# Altium schematic sheet Sheet1.SchDoc
size A4; SheetNumber: 1; SheetTotal: 2
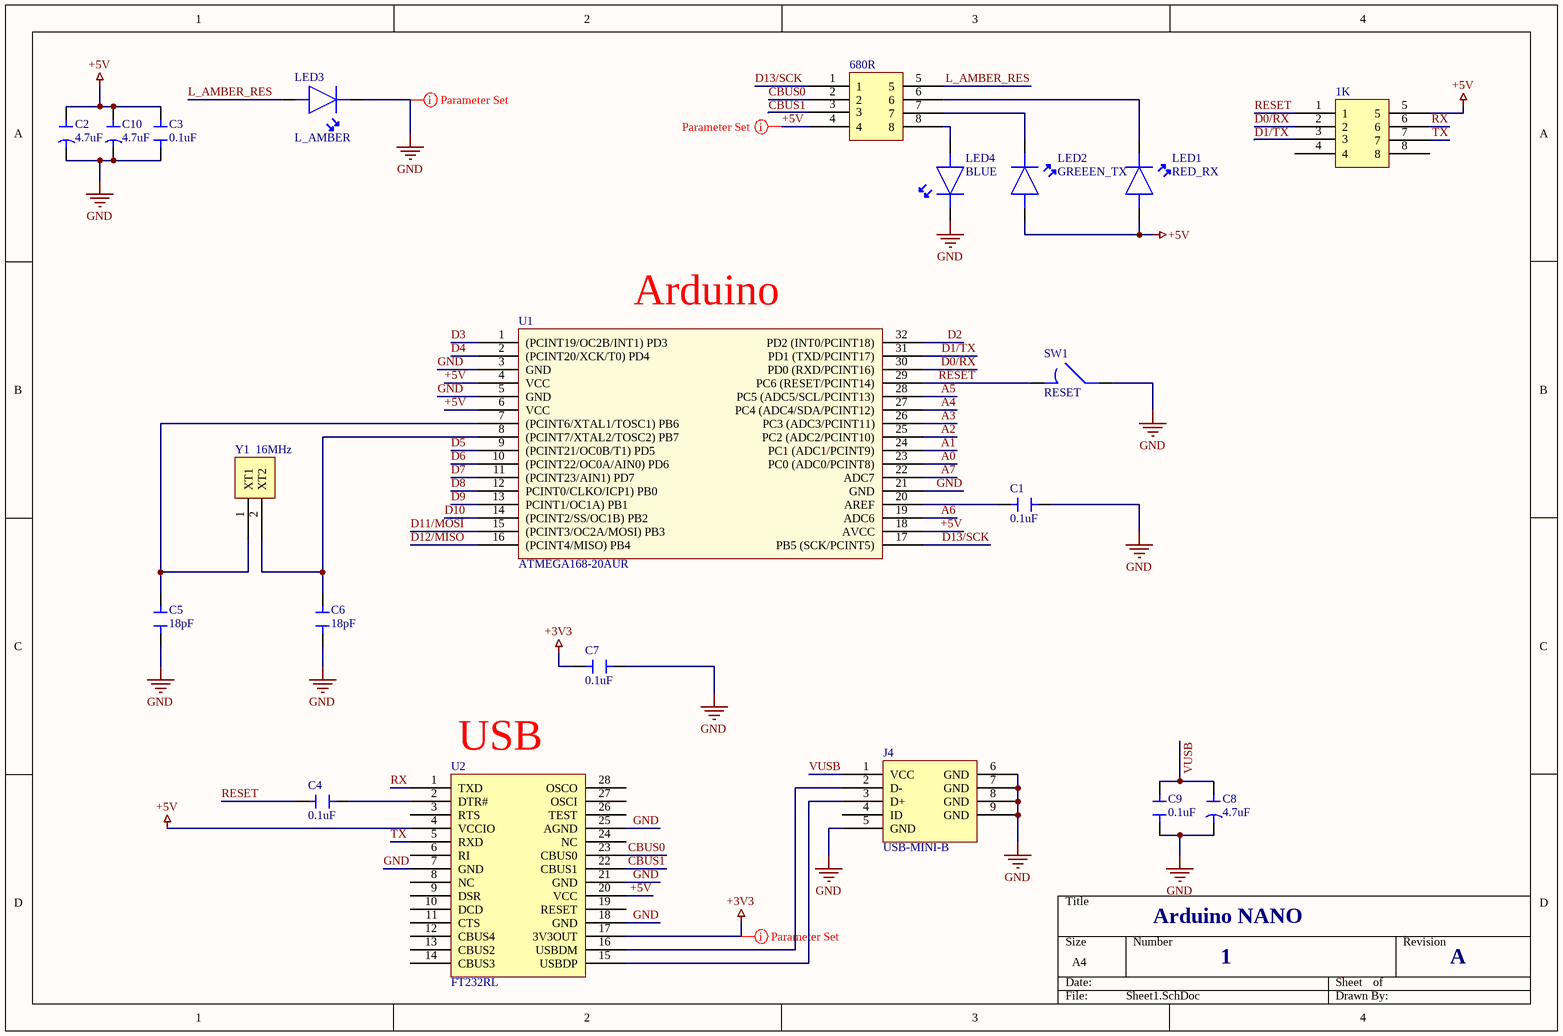
[diagram p0: Sheet1.SchDoc]

## Parts
1K  YC164-JR-071KL  [Quad8 RES ARRAY]  (value not drawn)
680R  YC164-JR-07680RL  [Quad8 RES ARRAY]  (value not drawn)
C1  0.1uF  [Capacitor 0805]
C2  4.7uF  [Tant 7343-43]
C3  0.1uF  [Capacitor 0805]
C4  0.1uF  [Capacitor 0805]
C5  18pF  [Capacitor 0805]
C6  18pF  [Capacitor 0805]
C7  0.1uF  [Capacitor 0805]
C8  4.7uF  [Tant 7343-43]
C9  0.1uF  [Capacitor 0805]
C10  4.7uF  [Tant 7343-43]
J4  USB-MINI-B  [Mini B]
LED1  RED_RX  [LED 0805]
LED2  GREEEN_TX  [LED 0805]
LED3  L_AMBER  [LED 0805]
LED4  BLUE  [LED 0805]
SW1  RESET  [PUSH BUTTON]
U1  ATMEGA168-20AUR  [TQFP]
U2  FT232RL  [Quad28 FTDI]
Y1  16MHz  [TH XT]

## Nets
+3V3: C7.2 U2.17(3V3OUT)
+5V: 1K.5 680R.4 C2.1 C3.1 C10.1 LED1.8 LED2.8 U1.4(VCC) U1.6(VCC) U1.18(AVCC) U2.4(VCCIO) U2.20(VCC)
GND: C1.2 C2.2 C3.2 C5.1 C6.1 C7.1 C8.2 C9.2 C10.2 J4.5(GND) J4.6(GND) J4.7(GND) J4.8(GND) J4.9(GND) LED3.7 LED4.7 SW1.10 U1.3(GND) U1.5(GND) U1.21(GND) U2.7(GND) U2.18(GND) U2.21(GND) U2.25(AGND)
A0: U1.23(PC0_(ADC0/PCINT8))
A1: U1.24(PC1_(ADC1/PCINT9))
A2: U1.25(PC2_(ADC2/PCINT10))
A3: U1.26(PC3_(ADC3/PCINT11))
A4: U1.27(PC4_(ADC4/SDA/PCINT12))
A5: U1.28(PC5_(ADC5/SCL/PCINT13))
A6: U1.19(ADC6)
A7: U1.22(ADC7)
CBUS0: 680R.2 U2.23(CBUS0)
CBUS1: 680R.3 U2.22(CBUS1)
D0/RX: 1K.2 U1.30(PD0_(RXD/PCINT16))
D1/TX: 1K.3 U1.31(PD1_(TXD/PCINT17))
D2: U1.32(PD2_(INT0/PCINT18))
D3: U1.1((PCINT19/OC2B/INT1)_PD3)
D4: U1.2((PCINT20/XCK/T0)_PD4)
D5: U1.9((PCINT21/OC0B/T1)_PD5)
D6: U1.10((PCINT22/OC0A/AIN0)_PD6)
D7: U1.11((PCINT23/AIN1)_PD7)
D8: U1.12(PCINT0/CLKO/ICP1)_PB0)
D9: U1.13(PCINT1/OC1A)_PB1)
D10: U1.14((PCINT2/SS/OC1B)_PB2)
D11/MOSI: U1.15((PCINT3/OC2A/MOSI)_PB3)
D12/MISO: U1.16((PCINT4/MISO)_PB4)
D13/SCK: 680R.1 U1.17(PB5_(SCK/PCINT5))
L_AMBER_RES: 680R.5 LED3.8
RESET: 1K.1 C4.2 SW1.9 U1.29(PC6_(RESET/PCINT14))
RX: 1K.6 U2.1(TXD)
TX: 1K.7 U2.5(RXD)
VUSB: C8.1 C9.1 J4.1(VCC)
Net680R_6: 680R.6 LED1.7
Net680R_7: 680R.7 LED2.7
Net680R_8: 680R.8 LED4.8
NetC1_1: C1.1 U1.20(AREF)
NetC4_1: C4.1 U2.2(DTR#)
NetC5_2: C5.2 U1.7((PCINT6/XTAL1/TOSC1)_PB6) Y1.1(XT1)
NetC6_2: C6.2 U1.8((PCINT7/XTAL2/TOSC2)_PB7) Y1.2(XT2)
NetJ4_2: J4.2(D-) U2.16(USBDM)
NetJ4_3: J4.3(D+) U2.15(USBDP)

Not connected (* = marked no-connect by the designer): 1K 4 8; J4 4(ID); U2 3(RTS) 6(RI) 8(NC) 9(DSR) 10(DCD) 11(CTS) 12(CBUS4) 13(CBUS2) 14(CBUS3) 19(RESET) 24(NC) 26(TEST) 27(OSCI) 28(OSCO)

## Layout directives
rule Width Constraint [Pref Width = 0.3mm    Min Width = 0.3mm    Max Width = 0.3mm]: +3V3, +5V, GND

## Notes on the sheet
- (near U1) Arduino
- (near U2) USB
- Arduino NANO
- 1
- A

## Library data of the parts
1K = YC164-JR-071KL: Res Thick Film Array 1KOhm 5% 200ppm/C ISOL Epoxy 8-Pin 1206(4 X 0603) Convex SMD T/R; Manufacturer: Yageo; Value: 1kR; Number of Resistors: 4; Temperature Coefficient: 200ppm/°C; Voltage Rating: 50V; Circuit Type: Isolated; Power Per Element: 62.5mW; Supplier: Digikey; Supplier Part Number: YC164J-1.0KCT-ND; Manufacturer Part Number: YC164-JR-071KL; RoHS: Yes; Category: Resistor Arrays; Stock: 106196; Pricing: 1=0.1, 10=0.083, 25=0.0604, 50=0.047, 100=0.032, 250=0.02624, 500=0.02086, 1000=0.0148 (USD); Mounting Technology: Surface Mount; Case/Package: 0603; Pins: 8; Case Code (Metric): 3216; Case Code (Imperial): 1206; Min Operating Temperature: -55°C; Max Operating Temperature: 155°C; Tolerance: 5%; Packaging: Cut Tape; Number of Elements: 4; Package Quantity: 1; Power Dissipation: 62.5mW; Working Voltage: 50V; Series: YC164; Resistance Tolerance: 5%; Technology: THICK FILM; Length: 0.126inch; Width: 0.063inch; Height: 0.028inch; Reach SVHC Compliant: Unknown; Lead Free: 5697LeadFree; RoHS Compliant: Yes; ComponentLink1URL: https://datasheet.ciiva.com/7620/443424-7620735.pdf?src-supplier=Element14; ComponentLink1Description: https://datasheet.ciiva.com/7620/443424-7620735.pdf?src-supplier=Element14
680R = YC164-JR-07680RL: Res Thick Film Array 680 Ohm 5% 200ppm/ C ISOL Molded 8-Pin 1206(4 X 0603) Convex SMD Paper T/R; Manufacturer: Yageo; Supplier: Digikey; Supplier Part Number: YC164J-680CT-ND; Manufacturer Part Number: YC164-JR-07680RL; RoHS: Yes; Category: Resistor Arrays; Stock: 20688; Pricing: 1=0.1, 10=0.083, 25=0.0604, 50=0.047, 100=0.032, 250=0.02624, 500=0.02086, 1000=0.0148 (USD); ComponentLink1URL: https://datasheet.ciiva.com/17201/pyu-yc-tc164-51-rohs-l-3-17201830.pdf?src-supplier=Future+Electronics; ComponentLink1Description: https://datasheet.ciiva.com/17201/pyu-yc-tc164-51-rohs-l-3-17201830.pdf?src-supplier=Future+Electronics; ComponentLink2URL: https://datasheet.ciiva.com/2688/pyu-yc-tc164-51-rohs-l-3-2688403.pdf?src-supplier=Digikey; ComponentLink2Description: https://datasheet.ciiva.com/2688/pyu-yc-tc164-51-rohs-l-3-2688403.pdf?src-supplier=Digikey; ComponentLink3URL: https://datasheet.ciiva.com/2688/pyu-yc-tc164-51-rohs-l-3-2688404.pdf?src-supplier=Digikey; ComponentLink3Description: https://datasheet.ciiva.com/2688/pyu-yc-tc164-51-rohs-l-3-2688404.pdf?src-supplier=Digikey; ComponentLink4URL: https://datasheet.ciiva.com/2688/pyu-yc-tc164-51-rohs-l-3-2688405.pdf?src-supplier=Digikey; ComponentLink4Description: https://datasheet.ciiva.com/2688/pyu-yc-tc164-51-rohs-l-3-2688405.pdf?src-supplier=Digikey
C1 = CL21F104ZBCNNNC: Category: Capacitors
C2 C8 C10 = 293D475X9050D2TE3: Cap Tant Solid 4.7uF 50V D CASE 10% (7.3 X 4.3 X 2.8mm) SMD 7343-31 1.2 Ohm 125 C T/R; Manufacturer: Vishay Sprague; Dielectric Material: 5684ConductorMaterial; Life (Hours): 1000Hour; Supplier: Digikey; Supplier Part Number: 718-1085-1-ND; Manufacturer Part Number: 293D475X9050D2TE3; RoHS: Yes; Category: Tantalum Capacitors; Stock: 9318; Pricing: 1=1.14, 10=0.856, 50=0.7806, 100=0.6395 (USD); Lead Free: 5697LeadFree; ComponentLink1URL: https://datasheet.ciiva.com/12882/293d-239871-12882510.pdf?src-supplier=Mouser; ComponentLink1Description: https://datasheet.ciiva.com/12882/293d-239871-12882510.pdf?src-supplier=Mouser; ComponentLink2URL: https://datasheet.ciiva.com/18710/293d-eng-18710687.pdf?src-supplier=Distrelec; ComponentLink2Description: https://datasheet.ciiva.com/18710/293d-eng-18710687.pdf?src-supplier=Distrelec; ComponentLink3URL: https://datasheet.ciiva.com/259/293d-259894.pdf?src-supplier=Digikey; ComponentLink3Description: https://datasheet.ciiva.com/259/293d-259894.pdf?src-supplier=Digikey; ComponentLink4URL: https://datasheet.ciiva.com/259/293d-259895.pdf?src-supplier=Digikey; ComponentLink4Description: https://datasheet.ciiva.com/259/293d-259895.pdf?src-supplier=Digikey; ComponentLink5URL: https://datasheet.ciiva.com/259/293d-259896.pdf?src-supplier=Digikey; ComponentLink5Description: https://datasheet.ciiva.com/259/293d-259896.pdf?src-supplier=Digikey
C3 C4 C7 C9 = VJ0805A180GXJCW1BC: Multilayer Ceramic Capacitor, 18 pF, 16 V, ± 2%, C0G (NP0), 0805 [2012 Metric]; Manufacturer: Vishay Vitramon; Dielectric Material: Tantalum; Value: 18pF; Voltage Rating (DC): 16V; Supplier: Digikey; Supplier Part Number: 720-VJ0805A180GXJCW1BCCT-ND; Manufacturer Part Number: VJ0805A180GXJCW1BC; RoHS: Yes; Category: Ceramic Capacitors; Stock: 2332; Pricing: 1=0.25, 10=0.16, 50=0.1014, 100=0.0811, 500=0.05856, 1000=0.0518 (USD); Mounting Technology: Surface Mount; Case/Package: 0805; Case Code (Imperial): 0805; Case Code (Metric): 2012; Min Operating Temperature: -55°C; Max Operating Temperature: 125°C; Tolerance: 2%; Packaging: Tape and Reel; Package Quantity: 4000; Dielectric: C0G; Termination: SMD/SMT; Series: VJ W1BC; Construction: Flat; Length: 2mm; Width: 1.25mm; Height: 1.45mm; Depth: 1.25mm; Lead Free: Lead Free; RoHS Compliant: Yes; ComponentLink1URL: https://datasheet.ciiva.com/11483/vjw1bcbascomseries-11483638.pdf?src-supplier=Avnet; ComponentLink1Description: https://datasheet.ciiva.com/11483/vjw1bcbascomseries-11483638.pdf?src-supplier=Avnet
C5 C6 = VJ0805A180GXJCW1BC: Multilayer Ceramic Capacitor, 18 pF, 16 V, ± 2%, C0G (NP0), 0805 [2012 Metric]; Manufacturer: Vishay Vitramon; Dielectric Material: Tantalum; Voltage Rating (DC): 16V; Supplier: Digikey; Supplier Part Number: 720-VJ0805A180GXJCW1BCCT-ND; Manufacturer Part Number: VJ0805A180GXJCW1BC; RoHS: Yes; Category: Ceramic Capacitors; Stock: 2332; Pricing: 1=0.25, 10=0.16, 50=0.1014, 100=0.0811, 500=0.05856, 1000=0.0518 (USD); Mounting Technology: Surface Mount; Case/Package: 0805; Case Code (Imperial): 0805; Case Code (Metric): 2012; Min Operating Temperature: -55°C; Max Operating Temperature: 125°C; Value: 18pF; Tolerance: 2%; Packaging: Tape and Reel; Package Quantity: 4000; Dielectric: C0G; Termination: SMD/SMT; Series: VJ W1BC; Construction: Flat; Length: 2mm; Width: 1.25mm; Height: 1.45mm; Depth: 1.25mm; Lead Free: Lead Free; RoHS Compliant: Yes; ComponentLink1URL: https://datasheet.ciiva.com/11483/vjw1bcbascomseries-11483638.pdf?src-supplier=Avnet; ComponentLink1Description: https://datasheet.ciiva.com/11483/vjw1bcbascomseries-11483638.pdf?src-supplier=Avnet
J4 = 67503-1020: Conn Mini USB 2.0 Type B RCP 5 POS 0.8mm Solder RA SMD 5 Terminal 1 Port USB OTG T/R; Manufacturer: Molex; Contact Resistance: 50mR; Max Voltage Rating (DC): 3.03kV; Gender: Receptacle; Current Rating: 1A; Voltage Rating (AC): 30V; Connector Type: USB,Receptacle; Number of Ports: 1; Insulation Resistance: 100MR; Number of Contacts: 5; Data Rate: 480Mbps; USB Standard: USB 2.0; Number of Logic Blocks (LABs): 56480; Number of Logic Elements/Cells: 149500; RAM Size: 7880704b; Number of I/Os: 240; Shielding: Shielded; Glow Wire Compliant: Non-compliant; Supplier: Digikey; Supplier Part Number: WM5461CT-ND; Manufacturer Part Number: 67503-1020; RoHS: Yes; Category: Headers and Wire Housings; Stock: 5774; Pricing: 1=1.2, 10=0.993, 100=0.8272 (USD); Case/Package: BGA; Contact Plating: Gold; Contact Material: Bronze,Copper Alloy,Copper; Color: Black,Grey; Housing Material: Nylon; Insulation Color: Black; Min Operating Temperature: 0°C; Max Operating Temperature: 50°C; Packaging: Tape and Reel; Package Quantity: 1; Voltage Rating: 30V; Termination: Solder; Max Voltage Rating (AC): 30V; Working Voltage: 30V; Orientation: Right Angle; Number of Positions: 5; Number of Circuits: 5; Number of Rows: 1; Features: Shielded; Series: 67503; Length: 9.9mm; Width: 6.9mm; Pitch: 0.8mm; Depth: 9mm; Terminal Pitch: 0.8mm; Lead Free: Lead Free; Flammability Rating: UL94 V-0; RoHS Compliant: Yes; Reach SVHC Compliant: Unknown; ComponentLink1URL: https://datasheet.ciiva.com/1099/1827209-1099037.pdf?src-supplier=Element14; ComponentLink1Description: https://datasheet.ciiva.com/1099/1827209-1099037.pdf?src-supplier=Element14; ComponentLink2URL: https://datasheet.ciiva.com/4598/0675031020-io-connectors-172123-4598933.pdf?src-supplier=Mouser; ComponentLink2Description: https://datasheet.ciiva.com/4598/0675031020-io-connectors-172123-4598933.pdf?src-supplier=Mouser; ComponentLink3URL: https://datasheet.ciiva.com/11731/0900766b812b4bc6-11731385.pdf?src-supplier=Rs; ComponentLink3Description: https://datasheet.ciiva.com/11731/0900766b812b4bc6-11731385.pdf?src-supplier=Rs; ComponentLink4URL: https://datasheet.ciiva.com/46385/1739445-46385126.pdf?src-supplier=Element14; ComponentLink4Description: https://datasheet.ciiva.com/46385/1739445-46385126.pdf?src-supplier=Element14; ComponentLink5URL: https://datasheet.ciiva.com/46385/1862938-46385125.pdf?src-supplier=Element14; ComponentLink5Description: https://datasheet.ciiva.com/46385/1862938-46385125.pdf?src-supplier=Element14
LED1-LED4 = APT2012SRCPRV: Category: Optoelectronics
SW1 = B3U-1000P: Switch Tactile N.O. SPST Round Button Gull Wing 0.05A 12VDC 1.5N SMD Embossed T/R; Manufacturer: Omron; Mechanical Life: 200000Cycles; Contact Current Rating: 50mA; Voltage Rating (DC): 12V; Contact Resistance: 100mR; Illumination Type: Non-Illuminated,Illuminated; Switch Travel: 0.15mm; Switch Function: Off-Mom; Actuator Type: Standard; Number of Positions: 2NUMBER; Actuator Length: 0.4mm; Ratings: Dust Proof,IP40; Supplier: Digikey; Supplier Part Number: SW1020CT-ND; Manufacturer Part Number: B3U-1000P; RoHS: Yes; Category: Tactile Switches; Stock: 4470; Pricing: 1=1.02, 10=0.983, 25=0.9188, 100=0.7977, 250=0.72584, 500=0.67292, 1000=0.62377 (USD); Mounting Technology: Surface Mount; Pins: 2NUMBER; Contact Material: Silver; Weight: 0.000776oz; Color: 56Colour; Min Operating Temperature: -25°C; Max Operating Temperature: 70°C; Operating Force: 1.5N; Max Current Rating: 50mA; Packaging: Tape and Reel; Throw Configuration: SPST; Package Quantity: 1; Max Voltage Rating (DC): 12V; Current Rating: 50mA; Termination: SMD/SMT; Electrical Life: 200000Cycles; Insulation Resistance: 100MR; Orientation: Straight; Series: B3U; Length: 4mm; Width: 3mm; Height: 1.2mm; Depth: 2.5mm; RoHS Compliant: Yes; Reach SVHC Compliant: Unknown; Lead Free: 5697LeadFree; ComponentLink1URL: https://datasheet.ciiva.com/22696/1685550-22696214.pdf?src-supplier=Element14; ComponentLink1Description: https://datasheet.ciiva.com/22696/1685550-22696214.pdf?src-supplier=Element14; ComponentLink2URL: https://datasheet.ciiva.com/1532/1685550-1532680.pdf?src-supplier=Element14; ComponentLink2Description: https://datasheet.ciiva.com/1532/1685550-1532680.pdf?src-supplier=Element14; ComponentLink3URL: https://datasheet.ciiva.com/1634/1685550-1634396.pdf?src-supplier=Farnell; ComponentLink3Description: https://datasheet.ciiva.com/1634/1685550-1634396.pdf?src-supplier=Farnell; ComponentLink4URL: https://datasheet.ciiva.com/16862/70176037-16862846.pdf?src-supplier=Allied+Electronics; ComponentLink4Description: https://datasheet.ciiva.com/16862/70176037-16862846.pdf?src-supplier=Allied+Electronics
U1 = ATMEGA168-20AUR: MCU 8-bit ATmega AVR RISC 16KB Flash 3.3V/5V 32-Pin TQFP T/R - Tape and Reel; Manufacturer: Microchip; Supplier: Digikey; Supplier Part Number: ATMEGA168-20AURCT-ND; Manufacturer Part Number: ATMEGA168-20AUR; RoHS: Yes; Category: Microcontrollers; Stock: 17943; Pricing: 1=3.86, 25=3.54, 100=3.2 (USD); ComponentLink1URL: https://datasheet.ciiva.com/9235/doc2545-9235241.pdf?src-supplier=Avnet; ComponentLink1Description: https://datasheet.ciiva.com/9235/doc2545-9235241.pdf?src-supplier=Avnet; ComponentLink2URL: https://datasheet.ciiva.com/1556/2545s-1556861.pdf?src-supplier=Digikey; ComponentLink2Description: https://datasheet.ciiva.com/1556/2545s-1556861.pdf?src-supplier=Digikey; ComponentLink3URL: https://datasheet.ciiva.com/1556/2545s-1556862.pdf?src-supplier=Digikey; ComponentLink3Description: https://datasheet.ciiva.com/1556/2545s-1556862.pdf?src-supplier=Digikey; ComponentLink4URL: https://datasheet.ciiva.com/1556/2545s-1556863.pdf?src-supplier=Digikey; ComponentLink4Description: https://datasheet.ciiva.com/1556/2545s-1556863.pdf?src-supplier=Digikey
U2 = FT232RL-REEL: IC USB FS SERIAL UART 28-SSOP; Manufacturer: FTDI; Number of Channels: 1; Max Supply Voltage: 5.25V; Min Supply Voltage: 3.3V; Data Rate: 12Mbps; Interface: UART,RS-232,RS-422,RS-485; Operating Supply Current: 15mA; Voltage: 5V; Supplier: Digikey; Supplier Part Number: 768-1007-6-ND; Manufacturer Part Number: FT232RL-REEL; RoHS: Yes; Category: Interface ICs; Pricing: 1=4.8 (USD); Mounting Technology: Surface Mount; Case/Package: SSOP; Pins: 28; Weight: 0.080001oz; Min Operating Temperature: -40°C; Max Operating Temperature: 85°C; Packaging: Tape and Reel; Package Quantity: 1; Number of Transceivers: 1; Series: USBmadeEZ-UART; Length: 10.2mm; Width: 5.3mm; Height: 1.75mm; Radiation Hardening: No; Reach SVHC Compliant: No; Lead Free: Lead Free; RoHS Compliant: Yes; ComponentLink1URL: https://datasheet.ciiva.com/34304/2161019-34304054.pdf?src-supplier=Jameco; ComponentLink1Description: https://datasheet.ciiva.com/34304/2161019-34304054.pdf?src-supplier=Jameco; ComponentLink2URL: https://datasheet.ciiva.com/4787/ds-ft232r-11534-4787658.pdf?src-supplier=Mouser; ComponentLink2Description: https://datasheet.ciiva.com/4787/ds-ft232r-11534-4787658.pdf?src-supplier=Mouser; ComponentLink3URL: https://datasheet.ciiva.com/1787/ds-ft232r-1787048.pdf?src-supplier=Digikey; ComponentLink3Description: https://datasheet.ciiva.com/1787/ds-ft232r-1787048.pdf?src-supplier=Digikey; ComponentLink4URL: https://datasheet.ciiva.com/1787/ds-ft232r-1787047.pdf?src-supplier=Digikey; ComponentLink4Description: https://datasheet.ciiva.com/1787/ds-ft232r-1787047.pdf?src-supplier=Digikey; ComponentLink5URL: https://datasheet.ciiva.com/1787/ds-ft232r-1787049.pdf?src-supplier=Digikey; ComponentLink5Description: https://datasheet.ciiva.com/1787/ds-ft232r-1787049.pdf?src-supplier=Digikey; ComponentLink6URL: https://datasheet.ciiva.com/16200/ds-ft232r-16200652.pdf?src-supplier=Future+Electronics; ComponentLink6Description: https://datasheet.ciiva.com/16200/ds-ft232r-16200652.pdf?src-supplier=Future+Electronics; ComponentLink7URL: https://datasheet.ciiva.com/15150/getdatasheetpartid-643207-15150506.pdf?src-supplier=Verical; ComponentLink7Description: https://datasheet.ciiva.com/15150/getdatasheetpartid-643207-15150506.pdf?src-supplier=Verical
Y1 = ABL-16.000MHZ-B2: Crystal 16MHz ±20ppm (Tol) ±50ppm (Stability) 18pF FUND 40Ohm 2-Pin HC-49/US Thru-Hole Bulk; Manufacturer: Abracon; Supplier: Digikey; Supplier Part Number: 535-9041-ND; Manufacturer Part Number: ABL-16.000MHZ-B2; RoHS: Yes; Category: Crystals; Stock: 2281; Pricing: 1=0.33, 10=0.278, 50=0.25, 100=0.2222, 500=0.21108, 1000=0.17776, 3000=0.16665, 5000=0.1611, 10000=0.15554 (USD); ComponentLink1URL: https://datasheet.ciiva.com/4945/abl-10083-4945184.pdf?src-supplier=Mouser; ComponentLink1Description: https://datasheet.ciiva.com/4945/abl-10083-4945184.pdf?src-supplier=Mouser; ComponentLink2URL: https://datasheet.ciiva.com/7998/abl-7998397.pdf?src-supplier=Element14; ComponentLink2Description: https://datasheet.ciiva.com/7998/abl-7998397.pdf?src-supplier=Element14; ComponentLink3URL: https://datasheet.ciiva.com/7998/abl-7998398.pdf?src-supplier=Element14; ComponentLink3Description: https://datasheet.ciiva.com/7998/abl-7998398.pdf?src-supplier=Element14; ComponentLink4URL: https://datasheet.ciiva.com/3175/abl-3175227.pdf?src-supplier=Avnet; ComponentLink4Description: https://datasheet.ciiva.com/3175/abl-3175227.pdf?src-supplier=Avnet; ComponentLink5URL: https://datasheet.ciiva.com/862/abl-862058.pdf?src-supplier=Digikey; ComponentLink5Description: https://datasheet.ciiva.com/862/abl-862058.pdf?src-supplier=Digikey